# EAGLE design Transmitter Board (EAGLE 5.07)
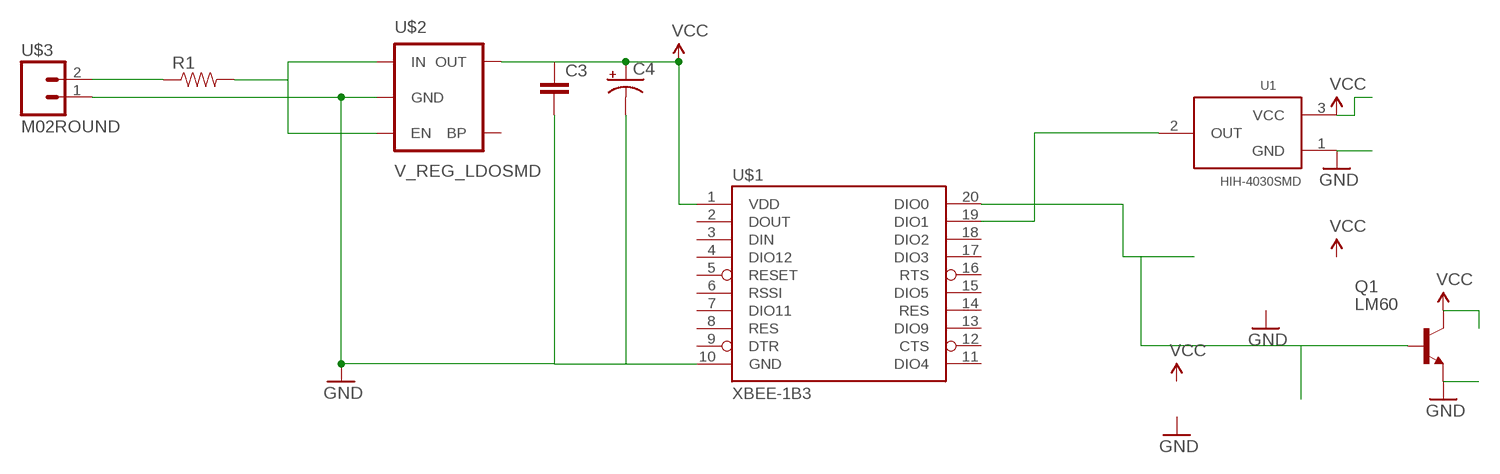
[diagram p0: schematic, sheet 1]

## Parts
C3  CAP0805  [0805]
C4  CAP_POL1206  [EIA3216]
Q1  LM60  BC487  [TO92-EBC]
R1  RESISTOR1206  [1206]
U1  HIH-4030SMD  [HIH-4030]
U$1  XBEE-1B3  [XBEE-SMD]
U$2  V_REG_LDOSMD  [SOT23-5]
U$3  M02ROUND  [A19423-ROUND]

## Nets
GND: C3.2 C4.C(-) Q1.E U1.1(GND) U$1.10(GND) U$2.2(GND) U$3.1
N$1: R1.2 U$2.1(IN) U$2.3(EN)
N$2: U1.2(OUT) U$1.19(DIO1)
N$3: R1.1 U$3.2
N$5: Q1.B U$1.20(DIO0)
VCC: C3.1 C4.A(+) Q1.C U1.3(VCC) U$1.1(VDD) U$2.5(OUT)
Unconnected: U$1.2(DOUT) U$1.3(DIN) U$1.4(DIO12) U$1.5(RESET) U$1.6(RSSI) U$1.7(DIO11) U$1.8(RES) U$1.9(DTR) U$1.11(DIO4) U$1.12(CTS) U$1.13(DIO9) U$1.14(RES) U$1.15(DIO5) U$1.16(RTS) U$1.17(DIO3) U$1.18(DIO2) U$2.4(BP)

## Library data of the parts
C3 = SparkFun:CAP: Capacitor Standard 0603 ceramic capacitor, and 0.1" leaded capacitor.
C4 = SparkFun:CAP_POL: Capacitor Polarized These are standard SMD and PTH capacitors. Normally 10uF, 47uF, and 100uF in electrolytic and tantalum varieties. Always verify the external diameter of the through hole cap, it varies with capacity, voltage, and manufacturer. The EIA devices should be standard.
Q1 = transistor-npn:BC487*: NPN Transistor
R1 = SparkFun:RESISTOR: Resistor Basic schematic elements and footprints for 0603, 1206, and PTH 1/10th watt (small) resistors.
U1 = SparkFun:HIH-4030: Humidity Sensor
U$1 = SparkFun:XBEE-1
U$2 = SparkFun:V_REG_LDO: Voltage Regulator LDO Standard 150mA LDO voltage regulator in SOT-23 layout. Micrel part MIC5205. BP (by-pass) pin is used to lower output noise with 470pF cap.
U$3 = _Part Repository:M02: 2-Position Headers

## Board
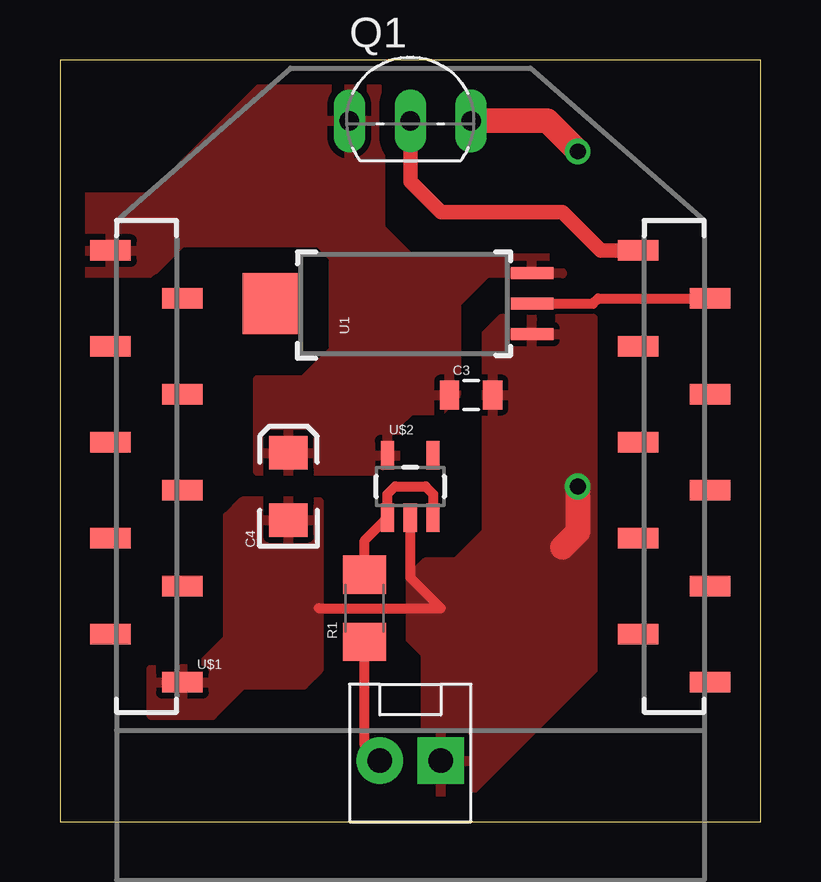
[diagram p1: board, top side]
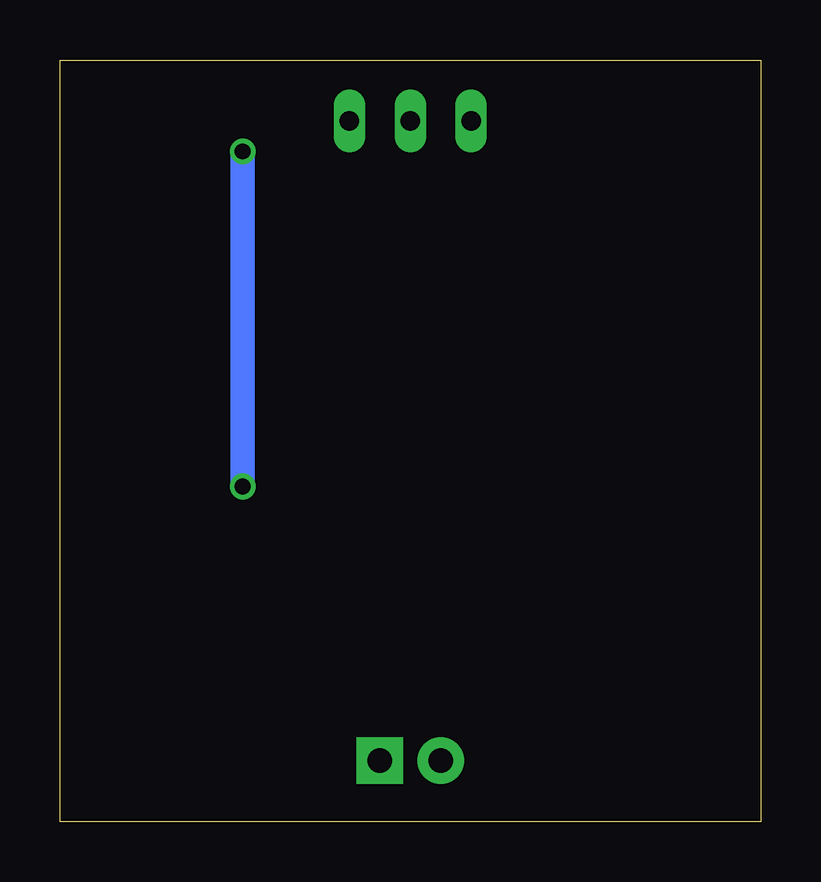
[diagram p2: board, bottom side, seen from below]

Size 29.21 x 31.75 mm. Coordinates in mm from the lower left corner, seen from the top.
Outline: 0,0 29.21,0 29.21,31.75 0,31.75 0,0
Copper layers (1*16): Top 0.035mm / dielectric 1.5mm / Bottom 0.035mm
Design rules "default": minimum track width 10mil, minimum drill 24mil, track to track 8mil, track to pad 8mil, pad to pad 8mil, via to via 8mil, smd to smd 8mil, copper to edge 40mil, drill to drill 8mil, minimum pad ring 10mil, minimum via ring 8mil, stop-mask expansion 4mil, vias tented up to drill 0mil, thermal gap 10mil

### Footprints (pad centres in the part's own frame; a part is rotated, then mirrored left to right if it is on the bottom)
0805 = smd 0.8 x 1.2: 1 -0.9,0; 2 0.9,0
EIA3216 = smd 1.4 x 1.6: A 1.4,0; C -1.4,0
TO92-EBC = drill 0.813 long: B 0,-1.27; C -2.54,-1.27; E 2.54,-1.27
1206 = smd 1.6 x 1.8: 1 -1.4,0; 2 1.4,0
HIH-4030 = smd 0.508 x 1.778: 1 -1.27,-5.08; 2 0,-5.08; 3 1.27,-5.08 | smd 2.54 x 2.286: NC 0,5.842
XBEE-SMD = smd 1.7 x 0.85: 1 -12.5,20; 2 -9.5,18; 3 -12.5,16; 4 -9.5,14; 5 -12.5,12; 6 -9.5,10; 7 -12.5,8; 8 -9.5,6; 9 -12.5,4; 10 -9.5,2; 11 12.5,2; 12 9.5,4; 13 12.5,6; 14 9.5,8; 15 12.5,10; 16 9.5,12; 17 12.5,14; 18 9.5,16; 19 12.5,18; 20 9.5,20
SOT23-5 = smd 0.55 x 1.2: 1 -0.95,-1.3; 2 0,-1.3; 3 0.95,-1.3; 4 0.95,1.3; 5 -0.95,1.3
A19423-ROUND = drill 1.02 pad 1.93 square: 1 1.27,0 | drill 1.02 pad 1.93 round: 2 -1.27,0

### Placement (x,y rotation side)
C3  17.15,17.78 0 top
C4  9.52,13.97 90 top
Q1  14.61,30.48 0 top
R1  12.7,8.89 90 top
U1  14.61,21.59 90 top
U$1  14.61,3.81 0 top
U$2  14.61,13.97 0 top
U$3  14.61,2.54 0 top

### Tracks (layer width: path | path; a pad name or v marks a point on that pad's centre or on a via)
GND  (via drill 0.66)
  Top 0.406: U$2.2 14.61,10.16 15.88,8.89 10.8,8.89
  Top 1.016: Q1.E 20.32,29.21 v21.59,27.94 | v21.59,13.97 21.59,12.06 20.95,11.43
  Bottom 1.016: v21.59,13.97 v21.59,27.94
  pour Top: 15.24,3.81 15.24,1.27 17.15,1.27 17.78,1.91 22.23,6.35 22.23,20.95 18.41,20.95 17.78,20.32 17.78,17.14 17.78,12.06 17.15,11.43 16.51,10.79 15.24,10.79 14.61,10.16 14.61,7.62 15.24,6.99
  pour Top (isolate 0.635): 10.8,13.33 7.62,13.33 6.98,12.7 6.98,7.62 5.71,6.35 3.81,6.35 3.81,4.44 6.35,4.44 7.62,5.72 10.16,5.72 10.8,6.35
N$1
  Top 0.406: 15.61,12.62 U$2.3 15.55,13.65 15.24,13.97 13.97,13.97 13.66,13.65 U$2.1 | U$2.1 13.34,12.35 | R1.2 12.7,11.71 U$2.1
N$2
  Top 0.406: U$1.19 22.45,21.81 22.23,21.59 U1.2
N$3
  Top 0.406: R1.1 12.7,3.17 U$3.2
N$5
  Top 0.61: Q1.B 14.61,26.67 15.88,25.4 20.95,25.4 22.55,23.81 U$1.20
VCC
  pour Top (isolate 0.635): 13.97,14.61 8.25,14.61 8.25,15.24 8.25,18.41 10.16,18.41 11.43,19.68 11.43,23.49 10.8,24.13 5.08,24.13 3.81,22.86 0.64,22.86 0.64,26.04 3.81,26.04 8.89,31.11 12.7,31.11 13.34,30.48 13.34,24.76 14.61,23.49 20.32,23.49 20.95,22.86 17.78,22.86 17.15,22.22 16.51,21.59 16.51,17.78 15.88,17.14 14.61,17.14 13.97,16.51